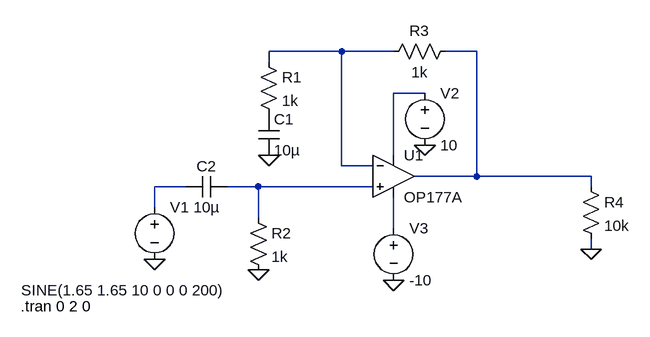
[diagram p0: schematic Non-inverting level shifter.asc]
Non-inverting level shifter.asc, the LTspice schematic file:
Version 4
SHEET 1 1032 680
WIRE 416 -112 304 -112
WIRE 496 -112 416 -112
WIRE 624 -112 576 -112
WIRE 304 -96 304 -112
WIRE 544 -48 496 -48
WIRE 496 48 496 -48
WIRE 416 64 416 -112
WIRE 464 64 416 64
WIRE 624 80 624 -112
WIRE 624 80 528 80
WIRE 800 80 624 80
WIRE 176 96 128 96
WIRE 288 96 240 96
WIRE 464 96 288 96
WIRE 800 96 800 80
WIRE 128 128 128 96
WIRE 288 144 288 96
WIRE 496 160 496 112
WIRE 800 192 800 176
FLAG 128 208 0
FLAG 304 48 0
FLAG 288 224 0
FLAG 544 32 0
FLAG 496 240 0
FLAG 800 192 0
SYMBOL voltage 128 112 R0
WINDOW 3 -205 143 Left 2
WINDOW 123 0 0 Left 0
WINDOW 39 0 0 Left 0
SYMATTR InstName V1
SYMATTR Value SINE(1.65 1.65 10 0 0 0 200)
SYMBOL res 288 -112 R0
SYMATTR InstName R1
SYMATTR Value 1k
SYMBOL res 272 128 R0
SYMATTR InstName R2
SYMATTR Value 1k
SYMBOL res 592 -128 R90
WINDOW 0 0 56 VBottom 2
WINDOW 3 32 56 VTop 2
SYMATTR InstName R3
SYMATTR Value 1k
SYMBOL cap 288 -16 R0
SYMATTR InstName C1
SYMATTR Value 10µ
SYMBOL cap 240 80 R90
WINDOW 0 0 32 VBottom 2
WINDOW 3 32 32 VTop 2
SYMATTR InstName C2
SYMATTR Value 10µ
SYMBOL OpAmps\\OP177A 496 16 R0
SYMATTR InstName U1
SYMBOL voltage 544 -64 R0
WINDOW 123 0 0 Left 0
WINDOW 39 0 0 Left 0
SYMATTR InstName V2
SYMATTR Value 10
SYMBOL voltage 496 144 R0
WINDOW 123 0 0 Left 0
WINDOW 39 0 0 Left 0
SYMATTR InstName V3
SYMATTR Value -10
SYMBOL res 784 80 R0
SYMATTR InstName R4
SYMATTR Value 10k
TEXT -78 280 Left 2 !.tran 0 2 0

The netlist it stands for:
* Non-inverting level shifter.asc
V1 N004 0 SINE(1.65 1.65 10 0 0 0 200)
R1 N001 P001 1k
R2 N005 0 1k
R3 N002 N001 1k
C1 P001 0 10µ
C2 N005 N004 10µ
XU1 N005 N001 N003 N006 N002 OP177A  ; pins In+ In- V+ V- OUT
V2 N003 0 10
V3 N006 0 -10
R4 N002 0 10k
.tran 0 2 0
.backanno
.end